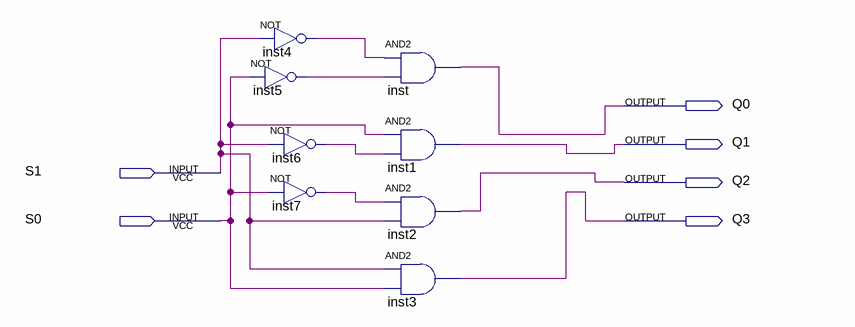
[diagram p0: schematic sheet]
// Quartus schematic 4_bits_demux.bdf as structural Verilog: 8 symbols, 6 pins
module \4_bits_demux  (
  input  S1,
  input  S0,
  output Q0,
  output Q1,
  output Q2,
  output Q3
);

  wire inst4_out, inst5_out, inst6_out, inst7_out;

  not inst4 (inst4_out, S1);
  not inst5 (inst5_out, S0);
  not inst6 (inst6_out, S1);
  not inst7 (inst7_out, S0);
  and inst (Q0, inst4_out, inst5_out);
  and inst1 (Q1, S0, inst6_out);
  and inst2 (Q2, inst7_out, S1);
  and inst3 (Q3, S1, S0);
endmodule
